# EAGLE design mux1 (EAGLE 6.5.0)
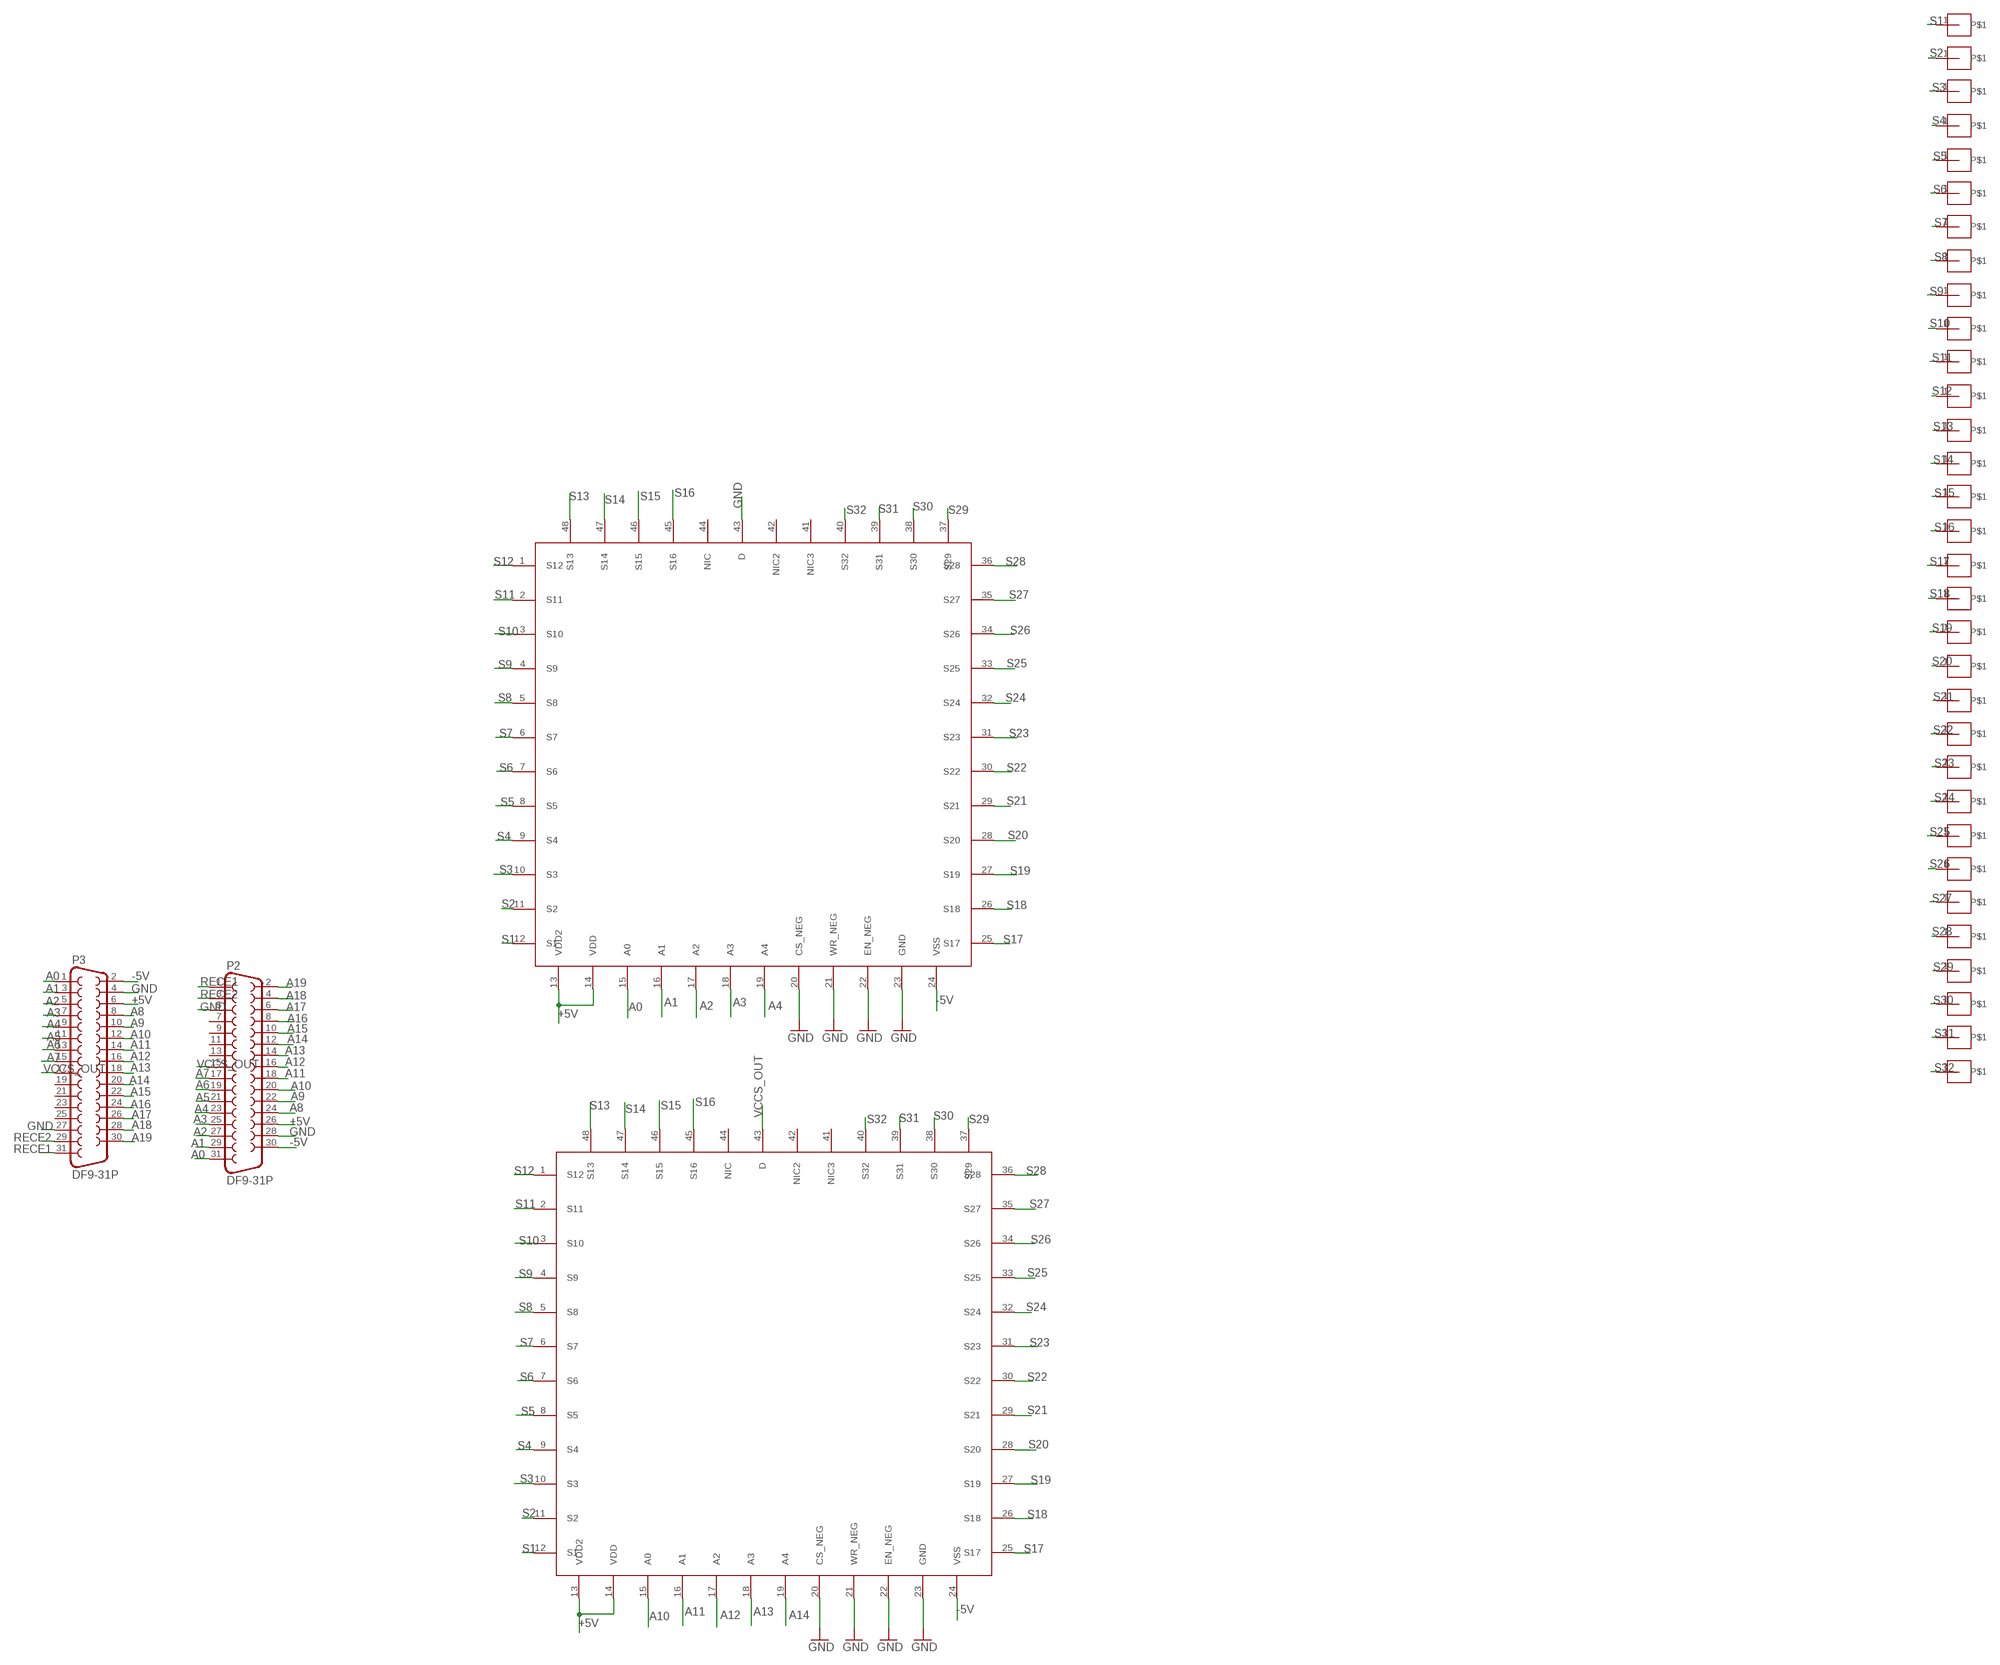
[diagram p0: schematic, sheet 1]

## Parts
P2  DF9-31P  [DF9-31P]
P3  DF9-31P  [DF9-31P]
U$3  ADG732  [TQFP48]
U$21  ADG732  [TQFP48]
U$25  M01  [M01]
U$26  M01  [M01]
U$27  M01  [M01]
U$28  M01  [M01]
U$29  M01  [M01]
U$30  M01  [M01]
U$31  M01  [M01]
U$32  M01  [M01]
U$33  M01  [M01]
U$34  M01  [M01]
U$35  M01  [M01]
U$36  M01  [M01]
U$37  M01  [M01]
U$38  M01  [M01]
U$39  M01  [M01]
U$40  M01  [M01]
U$41  M01  [M01]
U$42  M01  [M01]
U$43  M01  [M01]
U$44  M01  [M01]
U$45  M01  [M01]
U$46  M01  [M01]
U$47  M01  [M01]
U$48  M01  [M01]
U$49  M01  [M01]
U$50  M01  [M01]
U$51  M01  [M01]
U$52  M01  [M01]
U$53  M01  [M01]
U$54  M01  [M01]
U$55  M01  [M01]
U$56  M01  [M01]

## Nets
+5V: P2.26 P3.6 U$3.13(VDD2) U$3.14(VDD) U$21.13(VDD2) U$21.14(VDD)
-5V: P2.30 P3.2 U$3.24(VSS) U$21.24(VSS)
A0: P2.31 P3.1 U$3.15(A0)
A1: P2.29 P3.3 U$3.16(A1)
A2: P2.27 P3.5 U$3.17(A2)
A3: P2.25 P3.7 U$3.18(A3)
A4: P2.23 P3.9 U$3.19(A4)
A5: P2.21 P3.11
A6: P2.19 P3.13
A7: P2.17 P3.15
A8: P2.24 P3.8
A9: P2.22 P3.10
A10: P2.20 P3.12 U$21.15(A0)
A11: P2.18 P3.14 U$21.16(A1)
A12: P2.16 P3.16 U$21.17(A2)
A13: P2.14 P3.18 U$21.18(A3)
A14: P2.12 P3.20 U$21.19(A4)
A15: P2.10 P3.22
A16: P2.8 P3.24
A17: P2.6 P3.26
A18: P2.4 P3.28
A19: P2.2 P3.30
GND: P2.5 P2.28 P3.4 P3.27 U$3.20(CS_NEG) U$3.21(WR_NEG) U$3.22(EN_NEG) U$3.23(GND) U$3.43(D) U$21.20(CS_NEG) U$21.21(WR_NEG) U$21.22(EN_NEG) U$21.23(GND)
RECE1: P2.1 P3.31
RECE2: P2.3 P3.29
S1: U$3.12(S1) U$21.12(S1) U$25.1
S2: U$3.11(S2) U$21.11(S2) U$26.1
S3: U$3.10(S3) U$21.10(S3) U$27.1
S4: U$3.9(S4) U$21.9(S4) U$28.1
S5: U$3.8(S5) U$21.8(S5) U$29.1
S6: U$3.7(S6) U$21.7(S6) U$30.1
S7: U$3.6(S7) U$21.6(S7) U$31.1
S8: U$3.5(S8) U$21.5(S8) U$32.1
S9: U$3.4(S9) U$21.4(S9) U$33.1
S10: U$3.3(S10) U$21.3(S10) U$34.1
S11: U$3.2(S11) U$21.2(S11) U$35.1
S12: U$3.1(S12) U$21.1(S12) U$36.1
S13: U$3.48(S13) U$21.48(S13) U$37.1
S14: U$3.47(S14) U$21.47(S14) U$38.1
S15: U$3.46(S15) U$21.46(S15) U$39.1
S16: U$3.45(S16) U$21.45(S16) U$40.1
S17: U$3.25(S17) U$21.25(S17) U$41.1
S18: U$3.26(S18) U$21.26(S18) U$42.1
S19: U$3.27(S19) U$21.27(S19) U$43.1
S20: U$3.28(S20) U$21.28(S20) U$44.1
S21: U$3.29(S21) U$21.29(S21) U$45.1
S22: U$3.30(S22) U$21.30(S22) U$46.1
S23: U$3.31(S23) U$21.31(S23) U$47.1
S24: U$3.32(S24) U$21.32(S24) U$48.1
S25: U$3.33(S25) U$21.33(S25) U$49.1
S26: U$3.34(S26) U$21.34(S26) U$50.1
S27: U$3.35(S27) U$21.35(S27) U$51.1
S28: U$3.36(S28) U$21.36(S28) U$52.1
S29: U$3.37(S29) U$21.37(S29) U$53.1
S30: U$3.38(S30) U$21.38(S30) U$54.1
S31: U$3.39(S31) U$21.39(S31) U$55.1
S32: U$3.40(S32) U$21.40(S32) U$56.1
VCCS_OUT: P2.15 P3.17 U$21.43(D)
Unconnected: P2.7 P2.9 P2.11 P2.13 P3.19 P3.21 P3.23 P3.25 U$3.41(NIC3) U$3.42(NIC2) U$3.44(NIC) U$21.41(NIC3) U$21.42(NIC2) U$21.44(NIC)

## Library data of the parts
P2 P3 = con-hirose:DF9-31P
U$3 U$21 = Teensy_3_and_LC_Series_Boards_v1.1:ADG732
U$25-U$56 = Teensy_3_and_LC_Series_Boards_v1.1:M01

## Board
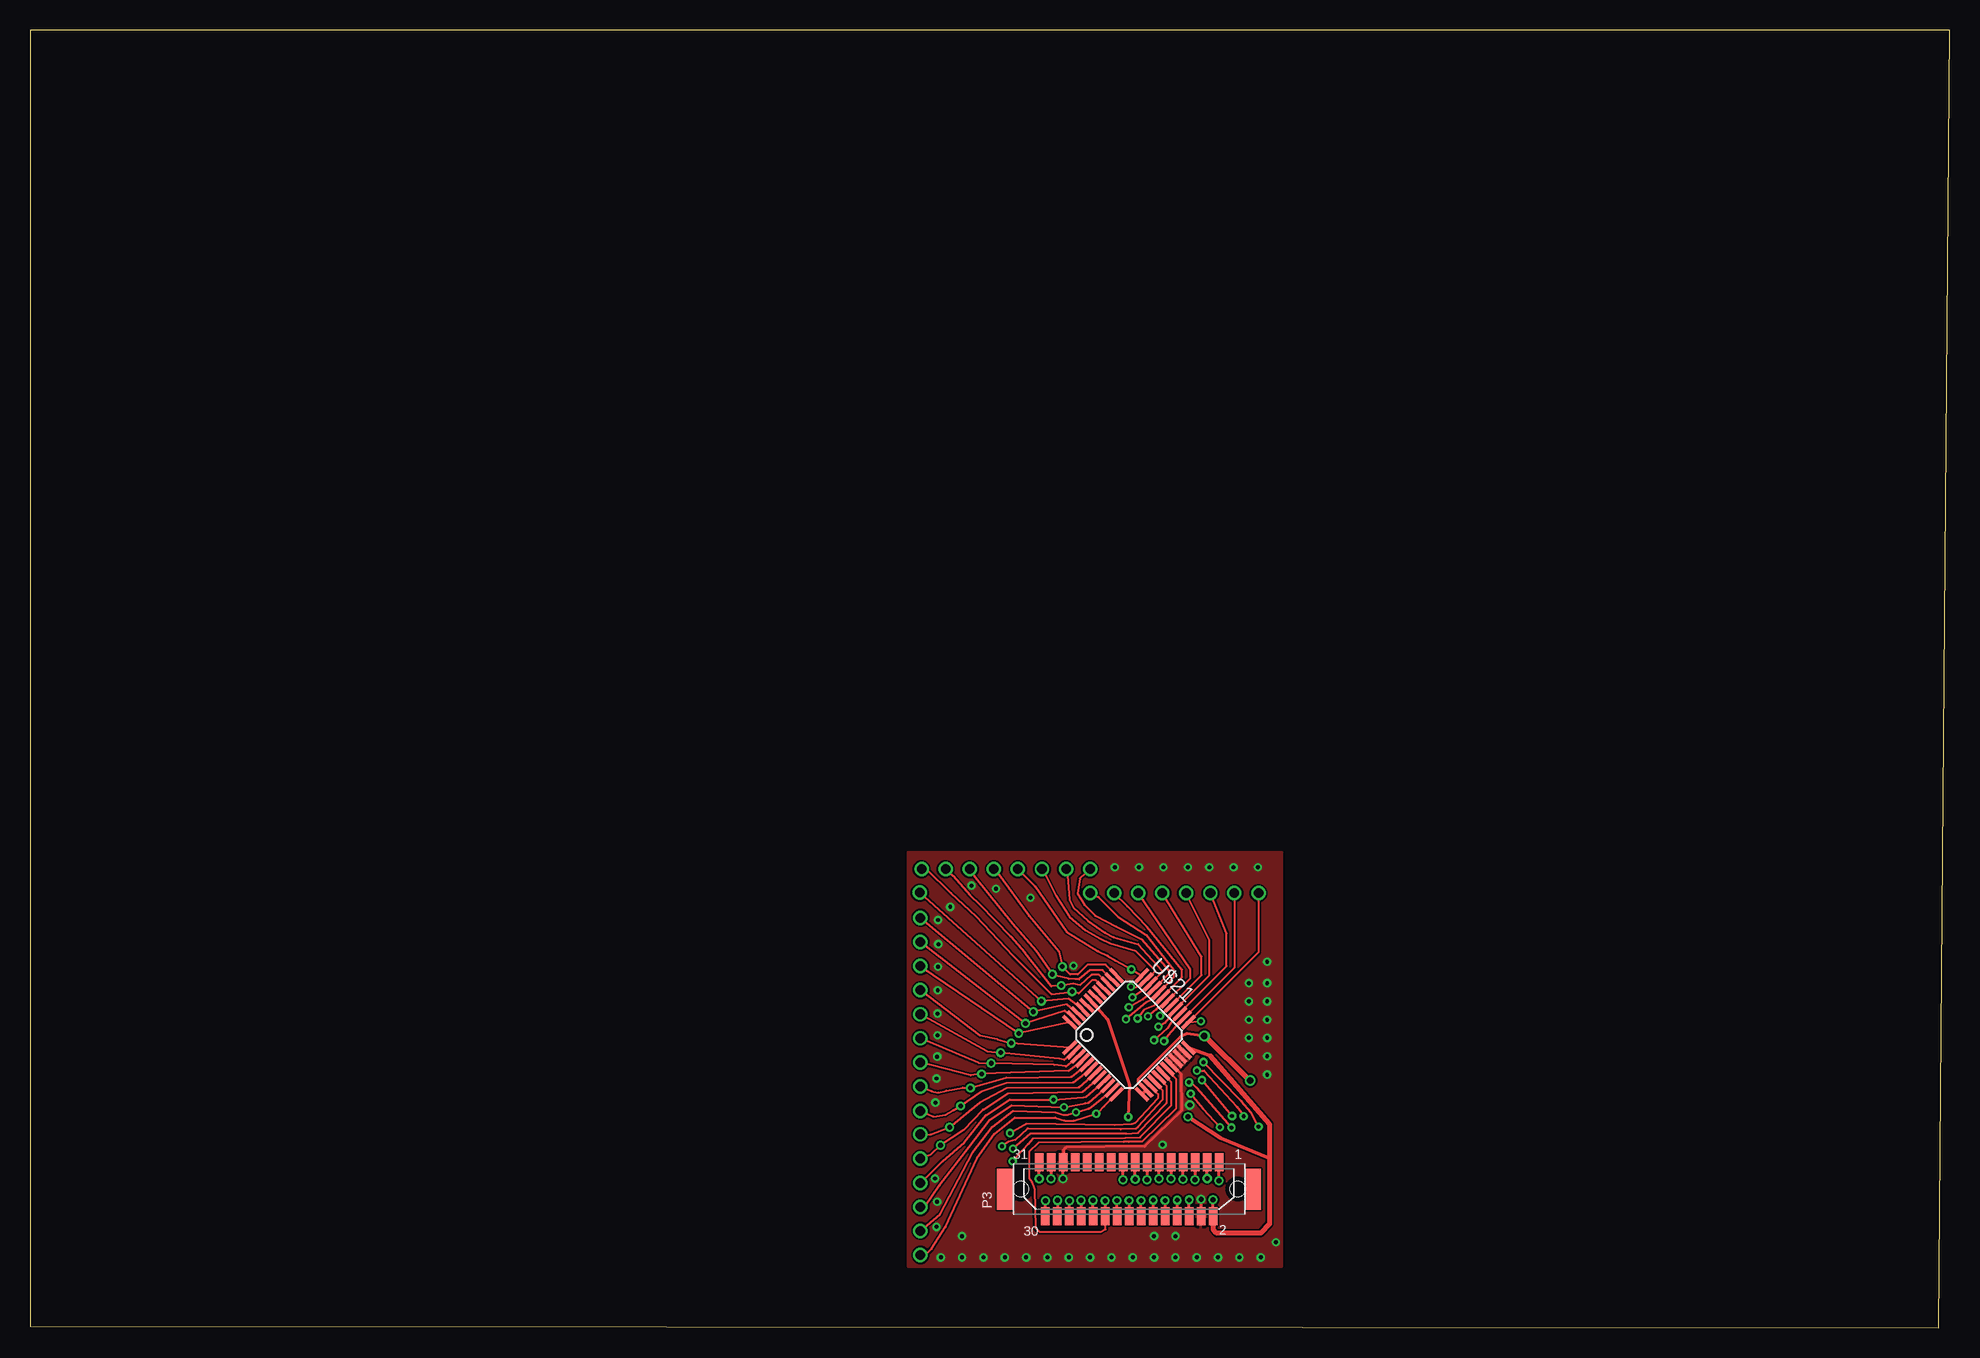
[diagram p1: board, top side]
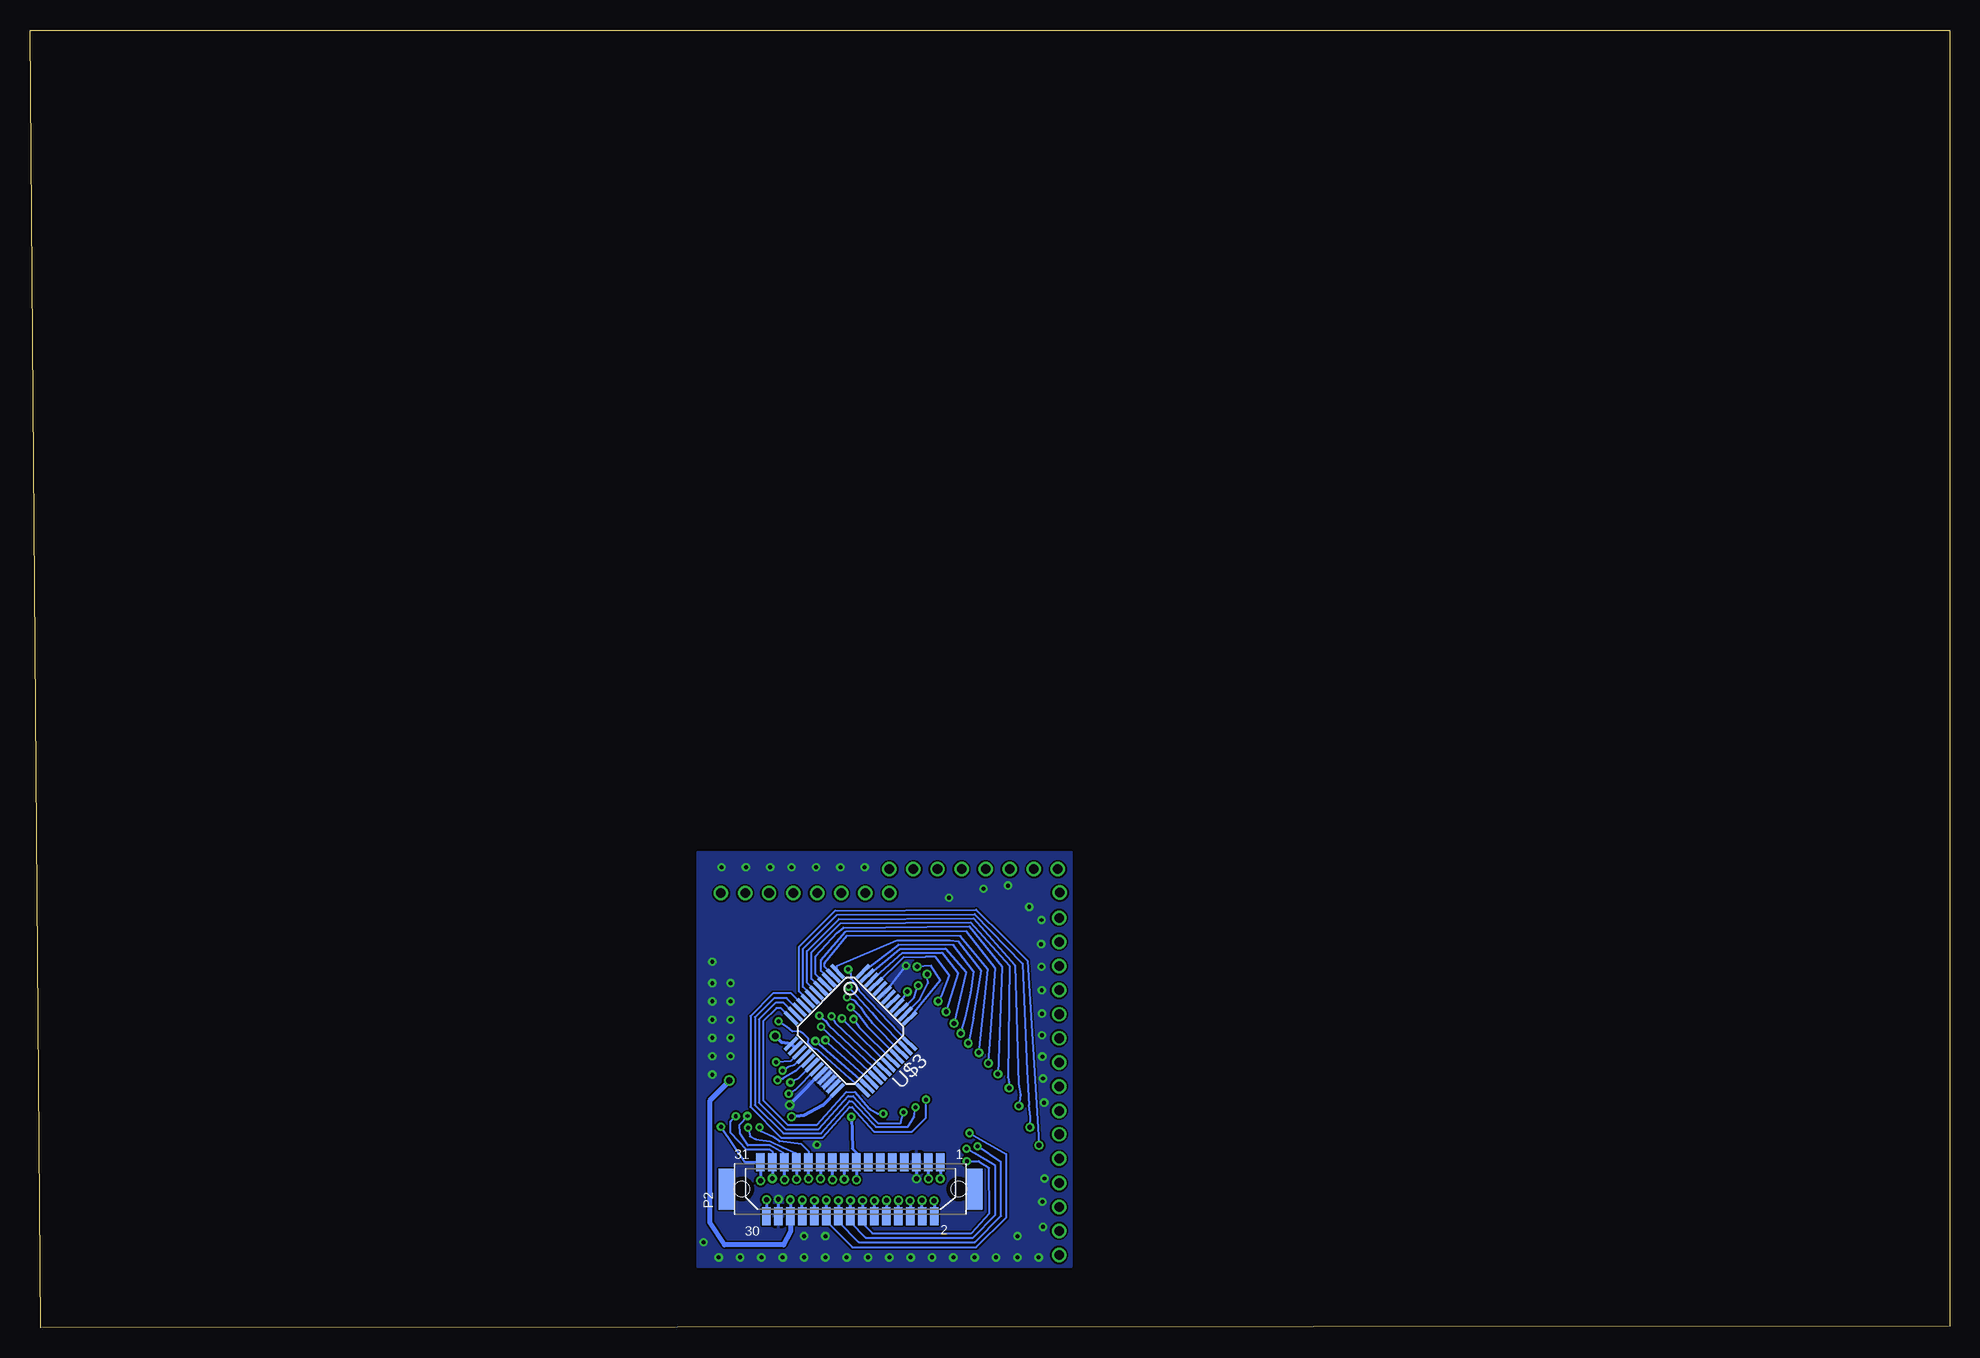
[diagram p2: board, bottom side, seen from below]

Size 160 x 108.15 mm. Coordinates in mm from the lower left corner, seen from the top.
Outline: 0,0.15 159.09,0 160,108.15 0,108.15 0,0.15
Copper layers (1*16): Top 0.0356mm / dielectric 1.5011mm / Bottom 0.0356mm
Design rules "LaenPCBOrder": minimum track width 6mil, minimum drill 13mil, track to track 6mil, track to pad 6mil, pad to pad 6mil, via to via 6mil, smd to smd 6mil, copper to edge 15mil, drill to drill 6mil, minimum pad ring 7mil, minimum via ring 7mil, stop-mask expansion 3mil, vias tented up to drill 0mil, thermal gap 10mil

### Footprints (pad centres in the part's own frame; a part is rotated, then mirrored left to right if it is on the bottom)
DF9-31P = smd 0.7 x 1.5: 1 7.5,2.25; 2 7,-2.25; 3 6.5,2.25; 4 6,-2.25; 5 5.5,2.25; 6 5,-2.25; 7 4.5,2.25; 8 4,-2.25; 9 3.5,2.25; 10 3,-2.25; 11 2.5,2.25; 12 2,-2.25; 13 1.5,2.25; 14 1,-2.25; 15 0.5,2.25; 16 0,-2.25; 17 -0.5,2.25; 18 -1,-2.25; 19 -1.5,2.25; 20 -2,-2.25; 21 -2.5,2.25; 22 -3,-2.25; 23 -3.5,2.25; 24 -4,-2.25; 25 -4.5,2.25; 26 -5,-2.25; 27 -5.5,2.25; 28 -6,-2.25; 29 -6.5,2.25; 30 -7,-2.25; 31 -7.5,2.25 | smd 1.3 x 3.4: M1 -10.35,0; M2 10.35,0 | hole 1.27: 9.05,0; -9.05,0
TQFP48 = smd 0.3 x 1.5: 1 -2.75,-4.25; 2 -2.25,-4.25; 3 -1.75,-4.25; 4 -1.25,-4.25; 5 -0.75,-4.25; 6 -0.25,-4.25; 7 0.25,-4.25; 8 0.75,-4.25; 9 1.25,-4.25; 10 1.75,-4.25; 11 2.25,-4.25; 12 2.75,-4.25; 25 2.75,4.25; 26 2.25,4.25; 27 1.75,4.25; 28 1.25,4.25; 29 0.75,4.25; 30 0.25,4.25; 31 -0.25,4.25; 32 -0.75,4.25; 33 -1.25,4.25; 34 -1.75,4.25; 35 -2.25,4.25; 36 -2.75,4.25 | smd 1.5 x 0.3: 13 4.25,-2.75; 14 4.25,-2.25; 15 4.25,-1.75; 16 4.25,-1.25; 17 4.25,-0.75; 18 4.25,-0.25; 19 4.25,0.25; 20 4.25,0.75; 21 4.25,1.25; 22 4.25,1.75; 23 4.25,2.25; 24 4.25,2.75; 37 -4.25,2.75; 38 -4.25,2.25; 39 -4.25,1.75; 40 -4.25,1.25; 41 -4.25,0.75; 42 -4.25,0.25; 43 -4.25,-0.25; 44 -4.25,-0.75; 45 -4.25,-1.25; 46 -4.25,-1.75; 47 -4.25,-2.25; 48 -4.25,-2.75
M01 = drill 0.8: 1 -0.025,-0.076

### Placement (x,y rotation side)
P2  91.62,11.56 0 bottom
P3  91.62,11.56 0 top
U$3  91.62,24.74 225 bottom
U$21  91.62,24.41 315 top
U$25  74.24,6.15 0 top
U$26  74.24,8.15 0 top
U$27  74.24,10.13 0 top
U$28  74.24,12.14 0 top
U$29  74.24,14.17 0 top
U$30  74.24,16.21 0 top
U$31  74.24,18.16 0 top
U$32  74.24,20.19 0 top
U$33  74.24,22.2 0 top
U$34  74.24,24.21 0 top
U$35  74.24,26.21 0 top
U$36  74.24,28.22 0 top
U$37  74.24,30.23 0 top
U$38  74.24,32.23 0 top
U$39  74.24,34.24 0 top
U$40  74.24,36.25 270 top
U$41  102.34,36.25 90 top
U$42  100.3,36.25 90 top
U$43  98.32,36.25 90 top
U$44  96.29,36.25 90 top
U$45  94.31,36.25 90 top
U$46  92.3,36.25 90 top
U$47  90.3,36.25 90 top
U$48  88.29,36.25 90 top
U$49  88.29,38.25 90 top
U$50  86.28,38.25 90 top
U$51  84.28,38.25 90 top
U$52  82.27,38.25 90 top
U$53  80.26,38.25 90 top
U$54  78.26,38.25 90 top
U$55  76.25,38.25 90 top
U$56  74.24,38.25 90 top

### Tracks (layer width: path | path; a pad name or v marks a point on that pad's centre or on a via)
+5V  (via drill 0.38, 0.53)
  Top 0.254: P3.6 v96.62,10.66 v96.62,10.67 | U$21.14 92.41,20.45 92.41,20.78 95.96,24.33 96.44,24.54 v97.89,24.33
  Top 0.305: U$21.14 U$21.13
  Top 0.406: v97.89,24.33 v101.7,20.6
  Bottom 0.254: v96.62,10.67 P3.6
  Bottom 0.305: U$3.14 U$3.13 97.36,23.78 v97.89,24.33
  Bottom 0.406: P3.6 96.62,8 97.18,6.91 102.11,6.91 103.33,8.76 103.3,18.95 v101.7,20.6
-5V  (via drill 0.41)
  Top 0.254: P3.2 98.6,9.31 v98.6,10.67
  Top 0.305: U$21.24 97.69,22.92 98.41,22.67 | v96.52,17.58 99.26,15.8 103.33,14.12
  Top 0.406: 98.41,22.67 103.3,16.99 103.33,14.12 103.33,8.66 102.56,7.9 98.91,7.9 98.63,8.18 P3.2
  Bottom 0.254: v98.6,10.67 98.62,10.67 P3.2
  Bottom 0.305: U$3.24 93.9,18.57 93.93,18.57 95.48,17.7 v96.52,17.58
A0  (via drill 0.33, 0.41)
  Top 0.152: v102.41,16.76 101.78,17.96 100.99,18.9 100.86,19 v97.81,22.15
  Top 0.254: v99.11,12.27 v99.12,12.27 P3.1
  Bottom 0.152: U$3.15 95.86,22.96 96.6,22.23 97.71,22.15 v97.81,22.15 | P3.1 100.38,13.81 v102.41,16.76
  Bottom 0.254: P3.1 v99.11,12.27
A1  (via drill 0.33, 0.41)
  Top 0.152: v97.28,21.44 97.87,21.44 100.58,18.42 v101.17,17.63
  Top 0.254: v98.12,12.45 P3.3
  Bottom 0.152: P3.3 98.12,14.68 98.35,14.86 100.25,14.86 101.6,16.26 101.6,17.2 v101.17,17.63 | U$3.16 95.59,22.62 96.32,21.89 96.75,21.77 v97.28,21.44
  Bottom 0.254: P3.3 v98.12,12.45
A2  (via drill 0.33, 0.41)
  Top 0.152: v97.69,20.65 97.69,20.62 v100.2,17.65
  Top 0.254: P3.5 97.1,13.81 v97.1,12.34
  Bottom 0.152: U$3.17 95.26,22.26 96.16,21.41 97.26,20.75 v97.69,20.65 | P3.5 97.16,13.84 97.16,14.53 98.32,15.21 100.15,15.21 100.81,16.23 100.84,16.94 v100.2,17.65
  Bottom 0.254: v97.1,12.34 97.12,12.34 P3.5
A3  (via drill 0.33, 0.41)
  Top 0.152: v96.62,20.45 96.98,20.27 97.21,20.04 v100.15,16.69
  Top 0.254: v96.11,12.4 v96.12,12.4 P3.7
  Bottom 0.152: U$3.18 94.9,21.91 94.9,21.84 95.96,20.78 96.29,20.65 v96.62,20.45 | P3.7 96.14,14.53 96.16,14.55 97.28,15.04 98.3,15.54 99.52,15.72 100,15.95 v100.15,16.69
  Bottom 0.254: P3.7 v96.11,12.4
A4  (via drill 0.33, 0.41)
  Top 0.152: v96.75,19.51 97.77,18.26 v99.19,16.71
  Top 0.254: P3.9 95.1,13.81 v95.1,12.42
  Bottom 0.152: U$3.19 94.52,21.56 94.52,21.53 96.24,19.81 96.62,19.61 v96.75,19.51 | P3.9 95.12,14.73 95.71,15.32 97.54,15.54 98.07,15.93 99.08,16.38 v99.19,16.71
  Bottom 0.254: v95.1,12.42 95.12,12.42 P3.9
A5  (via drill 0.41)
  Top 0.254: v94.11,12.42 v94.12,12.42 P3.11
  Bottom 0.254: P3.11 94.11,13.81 v94.11,12.42
A6  (via drill 0.41)
  Top 0.254: P3.13 v93.12,12.34
  Bottom 0.254: v93.12,12.34 P3.13
A7  (via drill 0.41)
  Top 0.254: v92.13,12.37 92.12,12.37 P3.15
  Bottom 0.254: P3.15 v92.13,12.37
A8  (via drill 0.38)
  Top 0.254: v95.63,10.64 95.62,10.64 P3.8
  Bottom 0.254: P3.8 v95.63,10.64
A9  (via drill 0.38)
  Top 0.254: v94.61,10.62 v94.62,10.62 P3.10
  Bottom 0.254: P3.10 v94.61,10.62
A10  (via drill 0.33, 0.38)
  Top 0.152: v81.69,16.23 83.06,16.99 90.4,16.89 91.85,16.97 92.1,17.07 94.03,19.15 94.03,19.48 93.39,20.13 U$21.15
  Top 0.254: v93.62,10.64 P3.12
  Bottom 0.152: v93.62,10.64 93.62,8.89 91.44,6.71 81.13,6.71 78.61,9.22 78.61,14.48 v81.69,16.23
  Bottom 0.254: P3.12 v93.62,10.64
A11  (via drill 0.33, 0.38)
  Top 0.152: U$21.16 93.74,20.46 94.39,19.81 94.39,19 92.35,16.74 92.15,16.61 90.93,16.54 83.21,16.61 83.13,16.61 82.14,15.67 81.56,15.52 v81.03,15.14
  Top 0.254: P3.14 92.61,9.31 v92.61,10.62
  Bottom 0.152: P3.14 92.62,8.82 90.93,7.14 81.23,7.14 79.05,9.32 79.07,13.82 v81.03,15.14
  Bottom 0.254: v92.61,10.62 v92.62,10.62 P3.14
A12  (via drill 0.33, 0.38)
  Top 0.152: v81.94,14.94 83.41,16.18 91.36,16.18 92.35,16.26 94.72,18.72 94.72,20.19 94.09,20.82 U$21.17
  Top 0.254: v91.62,10.62 P3.16
  Bottom 0.152: P3.16 91.62,8.79 90.35,7.52 81.38,7.52 79.53,9.42 79.53,13.49 81.28,14.55 v81.94,14.94
  Bottom 0.254: P3.16 v91.62,10.62
A13  (via drill 0.33, 0.38)
  Top 0.152: v81.92,13.89 83.19,15.32 83.62,15.8 91.29,15.82 92.53,15.88 95.1,18.49 95.1,20.5 94.45,21.15 U$21.18
  Top 0.254: P3.18 90.6,9.31 v90.6,10.62
  Bottom 0.152: P3.18 90.62,8.7 89.79,7.87 81.53,7.87 80.03,9.55 80.06,13.34 80.92,13.89 v81.92,13.89
  Bottom 0.254: v90.6,10.62 90.62,10.62 P3.18
A14  (via drill 0.38)
  Top 0.152: P3.20 89.64,9.29 89.66,8.2 89.26,8 84.15,8 83.8,8.36 83.74,11.53 83.69,11.68 83.52,12.12 83.29,12.47 83.29,14.66 84.05,15.42 91.16,15.49 91.59,15.49 92.69,15.52 95.5,18.24 95.5,20.78 94.8,21.48 U$21.19
  Top 0.254: v89.61,10.59 v89.62,10.59 P3.20
  Bottom 0.254: P3.20 v89.61,10.59
A15  (via drill 0.41)
  Top 0.254: P3.22 88.59,9.31 v88.59,10.62
  Bottom 0.254: v88.59,10.62 88.62,10.57 P3.22
A16  (via drill 0.41)
  Top 0.254: v87.61,10.62 87.62,10.62 P3.24
  Bottom 0.254: P3.24 87.61,9.31 v87.61,10.62
A17  (via drill 0.41)
  Top 0.254: P3.26 86.64,9.31 v86.64,10.59
  Bottom 0.254: v86.64,10.59 86.62,10.59 P3.26
A18  (via drill 0.41)
  Top 0.254: v85.65,10.62 85.64,10.54 P3.28
  Bottom 0.254: P3.28 85.65,9.31 v85.65,10.62
A19  (via drill 0.41)
  Top 0.254: P3.30 84.63,9.31 v84.63,10.59
  Bottom 0.254: v84.63,10.59 84.62,10.59 P3.30
GND  (via drill 0.33, 0.38, 0.41)
  Top 0.254: v86.11,12.42 86.12,12.57 P3.27 86.13,13.82 86.13,14.81 86.36,15.04 92.91,15.11 95.96,18.11 95.94,21.16 U$21.20 | v97.61,10.72 v97.62,10.72 P3.4
  Bottom 0.152: U$3.43 88.41,28.33 v86.97,30.18
  Bottom 0.254: P3.27 v86.11,12.42 | P3.4 v97.61,10.72
  Bottom 0.305: U$3.20 96.09,19.18 v96.67,18.57
  other vias: 94.41,15.27 103.12,21.11 103.12,22.63 103.12,24.16 103.12,25.68 103.12,27.2 103.12,28.73 103.12,30.51 101.6,28.73 101.6,27.2 101.6,25.68 101.6,24.16 101.6,22.63 102.36,38.38 100.33,38.38 98.3,38.38 96.52,38.38 94.49,38.38 92.46,38.38 90.42,38.38 83.39,35.84 80.52,36.6 78.49,36.86 76.71,35.08 75.69,33.99 75.72,31.98 75.69,30.1 75.67,28.14 75.64,26.19 75.64,24.38 75.62,22.61 75.56,20.78 75.56,8.41 75.62,10.52 75.44,12.45 75.46,18.77 75.92,5.87 77.7,5.87 79.48,5.87 81.25,5.87 83.03,5.87 84.81,5.87 86.59,5.87 88.37,5.87 90.14,5.87 91.92,5.87 93.7,5.87 95.48,5.87 97.26,5.87 99.03,5.87 100.81,5.87 102.59,5.87 103.86,7.14 77.7,7.65 95.48,7.65 93.7,7.65
  pour Bottom: 73.15,39.65 104.39,39.65 104.39,5.11 73.15,5.11
  pour Top: 73.15,5.11 104.39,5.11 104.39,39.65 73.15,39.65
RECE1  (via drill 0.41)
  Top 0.254: v84.12,12.42 84.12,12.6 P3.31
  Bottom 0.254: P3.31 84.1,13.81 v84.12,12.42
RECE2  (via drill 0.41)
  Top 0.254: P3.29 v85.11,12.42
  Bottom 0.254: v85.11,12.42 v85.12,12.42 P3.29
S1  (via drill 0.33)
  Top 0.152: U$25.1 74.65,6.07 75.16,6.58 76.33,8.41 78.92,14.12 80.42,16.15 82.07,17.53 85.45,17.53 86.26,17.27 87.02,17.27 v88.88,17.83 89.06,17.98 89.54,18.47 U$21.12
  Bottom 0.152: U$3.12 97.41,26.64 97.79,26.64 98.88,25.55 98.88,18.95 96.85,16.92 94.41,16.92 91.97,19.63 91.26,19.66 90.04,18.26 90.02,18.26 89.33,17.86 89.1,17.81 v88.88,17.83
S2  (via drill 0.33)
  Top 0.152: U$26.1 75.84,9.47 78.56,14.58 80.24,16.76 81.94,18.08 85.47,17.96 86.11,17.75 86.49,17.75 v87.2,17.96 88.22,18.26 88.45,18.39 U$21.11
  Bottom 0.152: U$3.11 96.26,26.15 97.18,27.08 97.87,27.08 99.24,25.7 99.24,18.77 97.03,16.56 94.26,16.56 91.8,19.3 91.39,19.3 89.81,17.55 89.33,17.07 87.43,17.07 v87.2,17.96
S3  (via drill 0.33)
  Top 0.152: U$27.1 74.55,10.06 75.82,11.86 78.26,15.06 80.03,17.32 81.81,18.54 v86.18,18.39 87.97,18.72 88.22,18.77 U$21.10
  Bottom 0.152: U$3.10 95.95,26.51 96.93,27.48 97.97,27.48 99.57,25.88 99.57,18.57 97.21,16.21 94.06,16.21 91.69,18.9 91.57,18.87 91.47,18.87 89.79,17.04 89.48,16.74 86.82,16.74 86.31,17.55 v86.18,18.39
S4  (via drill 0.33)
  Top 0.152: U$28.1 76.07,13.89 77.88,15.47 79.68,17.73 81.66,19.02 v85.32,19.02 87.77,19.2 88,19.25 U$21.9
  Bottom 0.152: U$3.9 95.54,26.86 96.57,27.89 98.04,27.89 99.95,25.98 99.95,18.42 97.38,15.85 93.95,15.85 91.69,18.39 91.47,18.39 89.64,16.36 86.49,16.36 85.32,17.53 v85.32,19.02
S5  (via drill 0.38)
  Top 0.152: U$29.1 75.11,14.48 v75.89,15.21 77.8,16.48 79.43,18.19 81.53,19.53 87.72,19.66 U$21.8
  Bottom 0.152: U$3.8 95.15,27.28 95.91,28.04 95.91,31.75 92.89,34.77 81.13,34.85 78.79,32.51 76.83,30.58 75.92,16 v75.89,15.21
S6  (via drill 0.38)
  Top 0.152: U$30.1 75.03,16.1 v76.66,16.71 79.2,18.8 81.43,19.99 87.42,20.07 U$21.7
  Bottom 0.152: U$3.7 94.8,27.64 95.58,28.42 95.58,31.57 92.73,34.42 81.25,34.47 77.27,30.35 76.89,21.44 76.73,18.57 76.61,17.58 v76.66,16.71
S7  (via drill 0.38)
  Top 0.152: U$31.1 75.31,17.6 76.33,17.75 76.96,18.14 v77.57,18.49 79.32,19.71 81.38,20.42 86.97,20.47 U$21.6
  Bottom 0.152: U$3.6 94.45,27.97 95.25,28.78 95.25,31.39 92.58,34.06 81.36,34.11 77.9,30.2 77.6,20.35 77.44,19.41 v77.57,18.49
S8  (via drill 0.38)
  Top 0.152: U$32.1 75.16,19.74 75.69,19.61 76.38,19.76 77.75,20.02 v78.38,19.99 81.36,20.85 86.8,20.93 U$21.5
  Bottom 0.152: U$3.5 94.09,28.31 94.87,29.08 94.87,31.29 92.46,33.71 81.58,33.78 78.36,30.18 78.49,20.88 78.41,20.47 v78.38,19.99
S9  (via drill 0.38)
  Top 0.152: U$21.4 86.57,21.41 v79.32,21.16 78.41,21.03 U$33.1
  Bottom 0.152: U$3.4 93.74,28.69 94.51,29.46 94.51,30.96 92.71,32.94 92.2,33.35 81.71,33.45 78.97,30.1 v79.32,21.16
S10  (via drill 0.38)
  Top 0.152: U$21.3 86.35,21.79 85.37,21.92 v80.11,22.05 79.07,22.07 U$34.1
  Bottom 0.152: U$3.3 93.39,29.05 94.08,29.74 94.06,30.63 92.02,32.99 81.94,33.05 79.53,29.97 v80.11,22.05
S11  (via drill 0.38)
  Top 0.152: U$21.2 86.2,22.33 85.78,22.43 v80.9,22.94 79.78,23.04 U$35.1
  Bottom 0.152: U$3.2 93.03,29.35 93.75,30.07 93.75,30.38 91.9,32.66 82.42,32.64 80.16,29.87 v80.9,22.94
S12  (via drill 0.38)
  Top 0.152: U$36.1 79.17,24.36 80.62,24.05 v81.79,23.72 U$21.1
  Bottom 0.152: U$3.1 92.73,30.16 87.73,32.28 83.31,32.28 82.6,32.21 80.7,29.74 81.36,25.83 v81.79,23.72
S13  (via drill 0.38)
  Top 0.152: U$21.48 v82.42,24.54 U$37.1
  Bottom 0.152: U$3.48 87.61,31.93 83.01,31.9 81.36,29.72 81.61,27.94 82.04,25.86 v82.42,24.54
S14  (via drill 0.38)
  Top 0.152: U$21.47 86.25,26.44 v82.98,25.37 U$38.1
  Bottom 0.152: U$3.47 87.48,31.57 83.69,31.6 81.97,29.62 v82.98,25.37
S15  (via drill 0.38)
  Top 0.152: U$21.46 86.45,26.95 v83.64,26.34 U$39.1
  Bottom 0.152: U$3.46 87.27,31.24 84,31.27 82.63,29.54 v83.64,26.34
S16  (via drill 0.38)
  Top 0.152: U$21.45 86.57,27.43 v84.3,27.23 U$40.1
  Bottom 0.152: U$3.45 87.17,30.89 85.34,30.94 84.53,30.91 83.36,29.39 84.02,27.64 v84.3,27.23
S17  (via drill 0.33)
  Top 0.152: v97.61,25.55 96.41,25.47 U$21.25 102.41,31.32 U$41.1
  Bottom 0.152: v97.61,25.55 96.93,25.12 96.44,24.71 95.76,24.66 95.61,24.59 95.12,24.1 95.15,23.7 94.74,23.29 94.36,23.19 91.67,20.8 91.62,20.75 91.06,20.27 90.96,20.17 90.94,20.17 U$3.25
S18  (via drill 0.33)
  Top 0.152: v94.54,23.9 94.87,24.38 95.43,25.04 U$21.26 100.38,29.99 U$42.1
  Bottom 0.152: U$3.26 90.22,20.19 v94.54,23.9
S19  (via drill 0.33)
  Top 0.152: v93.7,23.98 94.82,24.97 95.12,25.43 U$21.27 95.86,26.26 99.75,30.15 99.75,32.87 U$43.1
  Bottom 0.152: v93.7,23.98 93.48,23.72 U$3.27
S20  (via drill 0.33)
  Top 0.152: U$44.1 98.3,32.28 98.3,29.36 95.51,26.57 U$21.28 94.56,25.4 v94.06,25.1
  Bottom 0.152: U$3.28 v94.06,25.1
S21  (via drill 0.33)
  Top 0.152: v94.21,26.01 94.54,26.31 94.59,26.34 95.13,26.88 U$21.29 97.66,29.39 97.66,30.94 U$45.1
  Bottom 0.152: v94.21,26.01 93.9,25.76 93.7,25.58 93.42,25.23 U$3.29
S22  (via drill 0.33)
  Top 0.152: v93.19,25.96 93.6,26.29 93.9,26.54 U$21.30 94.83,27.24 96.72,29.13 96.72,29.87 U$46.1
  Bottom 0.152: v93.19,25.96 92.84,25.38 U$3.30
S23  (via drill 0.33)
  Top 0.152: v92.33,25.78 92.84,26.49 93.7,26.85 U$21.31 94.45,27.64 96.04,29.24 96.04,29.85 93.09,33.43 91.47,35.13 U$47.1
  Bottom 0.152: v92.33,25.78 91.8,25.27 U$3.31
S24  (via drill 0.33)
  Top 0.152: v91.36,25.73 93.07,27.15 93.4,27.28 94.06,27.95 U$21.32 95.02,28.87 95.02,28.91 95.33,29.21 95.33,29.85 93.02,32.74 90.7,34.24 89.08,35.89 U$48.1
  Bottom 0.152: v91.36,25.73 90.88,25.06 U$3.32
S25  (via drill 0.33)
  Top 0.152: v91.59,26.72 92.79,27.38 93.07,27.61 93.74,28.28 U$21.33 94.94,29.5 94.94,29.74 92.63,32.39 90.55,33.43 89.69,33.88 88.8,34.34 87.88,35.26 87.33,36.17 87.5,37.47 U$49.1
  Bottom 0.152: v91.59,26.72 90.93,26.11 90.25,25.14 U$3.33
S26  (via drill 0.33)
  Top 0.152: v91.9,27.56 92.85,28.18 93.39,28.64 U$21.34 94.36,29.63 94.36,29.74 92.35,31.98 90.32,32.56 89.61,32.94 88.19,33.91 87,35 86.67,35.66 86.44,38.23 U$50.1
  Bottom 0.152: v91.9,27.56 91.31,27.31 91.06,27.03 90.75,26.7 90.4,26.14 89.81,25.41 U$3.34
S27  (via drill 0.33)
  Top 0.152: v91.77,28.42 92.15,28.35 92.41,28.45 93.01,29.01 U$21.35 93.8,29.77 92.15,31.42 90.02,32.05 89.23,32.41 87.96,33.12 86.67,34.26 85.52,35.99 84.53,38.02 U$51.1
  Bottom 0.152: v91.77,28.42 91.44,28.07 91.11,27.69 90.73,27.25 89.86,26.31 89.41,25.76 U$3.35
S28  (via drill 0.33)
  Top 0.152: U$52.1 83.77,36.78 86.39,33.02 89.03,31.39 89.81,31.01 90.53,30.58 v91.8,29.87 U$21.36
  Bottom 0.152: v91.8,29.87 91.69,29.79 91.59,29.62 91.57,29.08 91.24,28.73 90.86,28.07 U$3.36
S29  (via drill 0.38)
  Top 0.152: U$53.1 80.64,37.92 83.26,34.34 85.78,31.34 v86.06,30.1 86.69,29.46 87.35,29.46 88.16,30.28 89.67,30.28 U$21.37
  Bottom 0.152: U$3.37 84.12,28.96 84.89,30.18 v86.06,30.1
S30  (via drill 0.38)
  Top 0.152: U$54.1 78.77,37.57 81.89,33.68 83.87,31.42 v85.22,29.46 85.52,29.34 86.59,29.08 87.12,29.06 87.45,29.03 88.34,29.82 89.42,29.82 U$21.38
  Bottom 0.152: U$3.38 87,26.15 85.85,27.36 85.14,28.75 v85.22,29.46
S31  (via drill 0.38)
  Top 0.152: U$55.1 76.94,37.67 78.36,36.07 79.2,35.26 81.71,32.61 82.93,31.24 85.14,28.45 v85.95,28.52 86.94,28.68 87.53,28.55 88.49,29.41 89.11,29.41 U$21.39
  Bottom 0.152: U$3.39 87.36,26.51 86.31,27.51 86.11,28.19 v85.95,28.52
S32  (via drill 0.38)
  Top 0.152: U$56.1 74.73,38.23 76.78,36.22 78.87,34.29 81.94,30.99 85.17,27.81 v86.87,28.02 87.1,27.94 87.43,27.86 88.52,28.96 88.84,28.96 U$21.40
  Bottom 0.152: U$3.40 87.72,26.86 87.07,27.66 v86.87,28.02
VCCS_OUT  (via drill 0.33, 0.41)
  Top 0.254: v91.12,12.34 P3.17 | U$21.43 88.48,27.24 89.81,25.73 91.64,20.22 v91.54,17.58
  Bottom 0.254: v91.12,12.34 v91.11,12.34 P3.17 91.11,13.82 91.11,14.61 91.44,14.94 v91.54,17.58